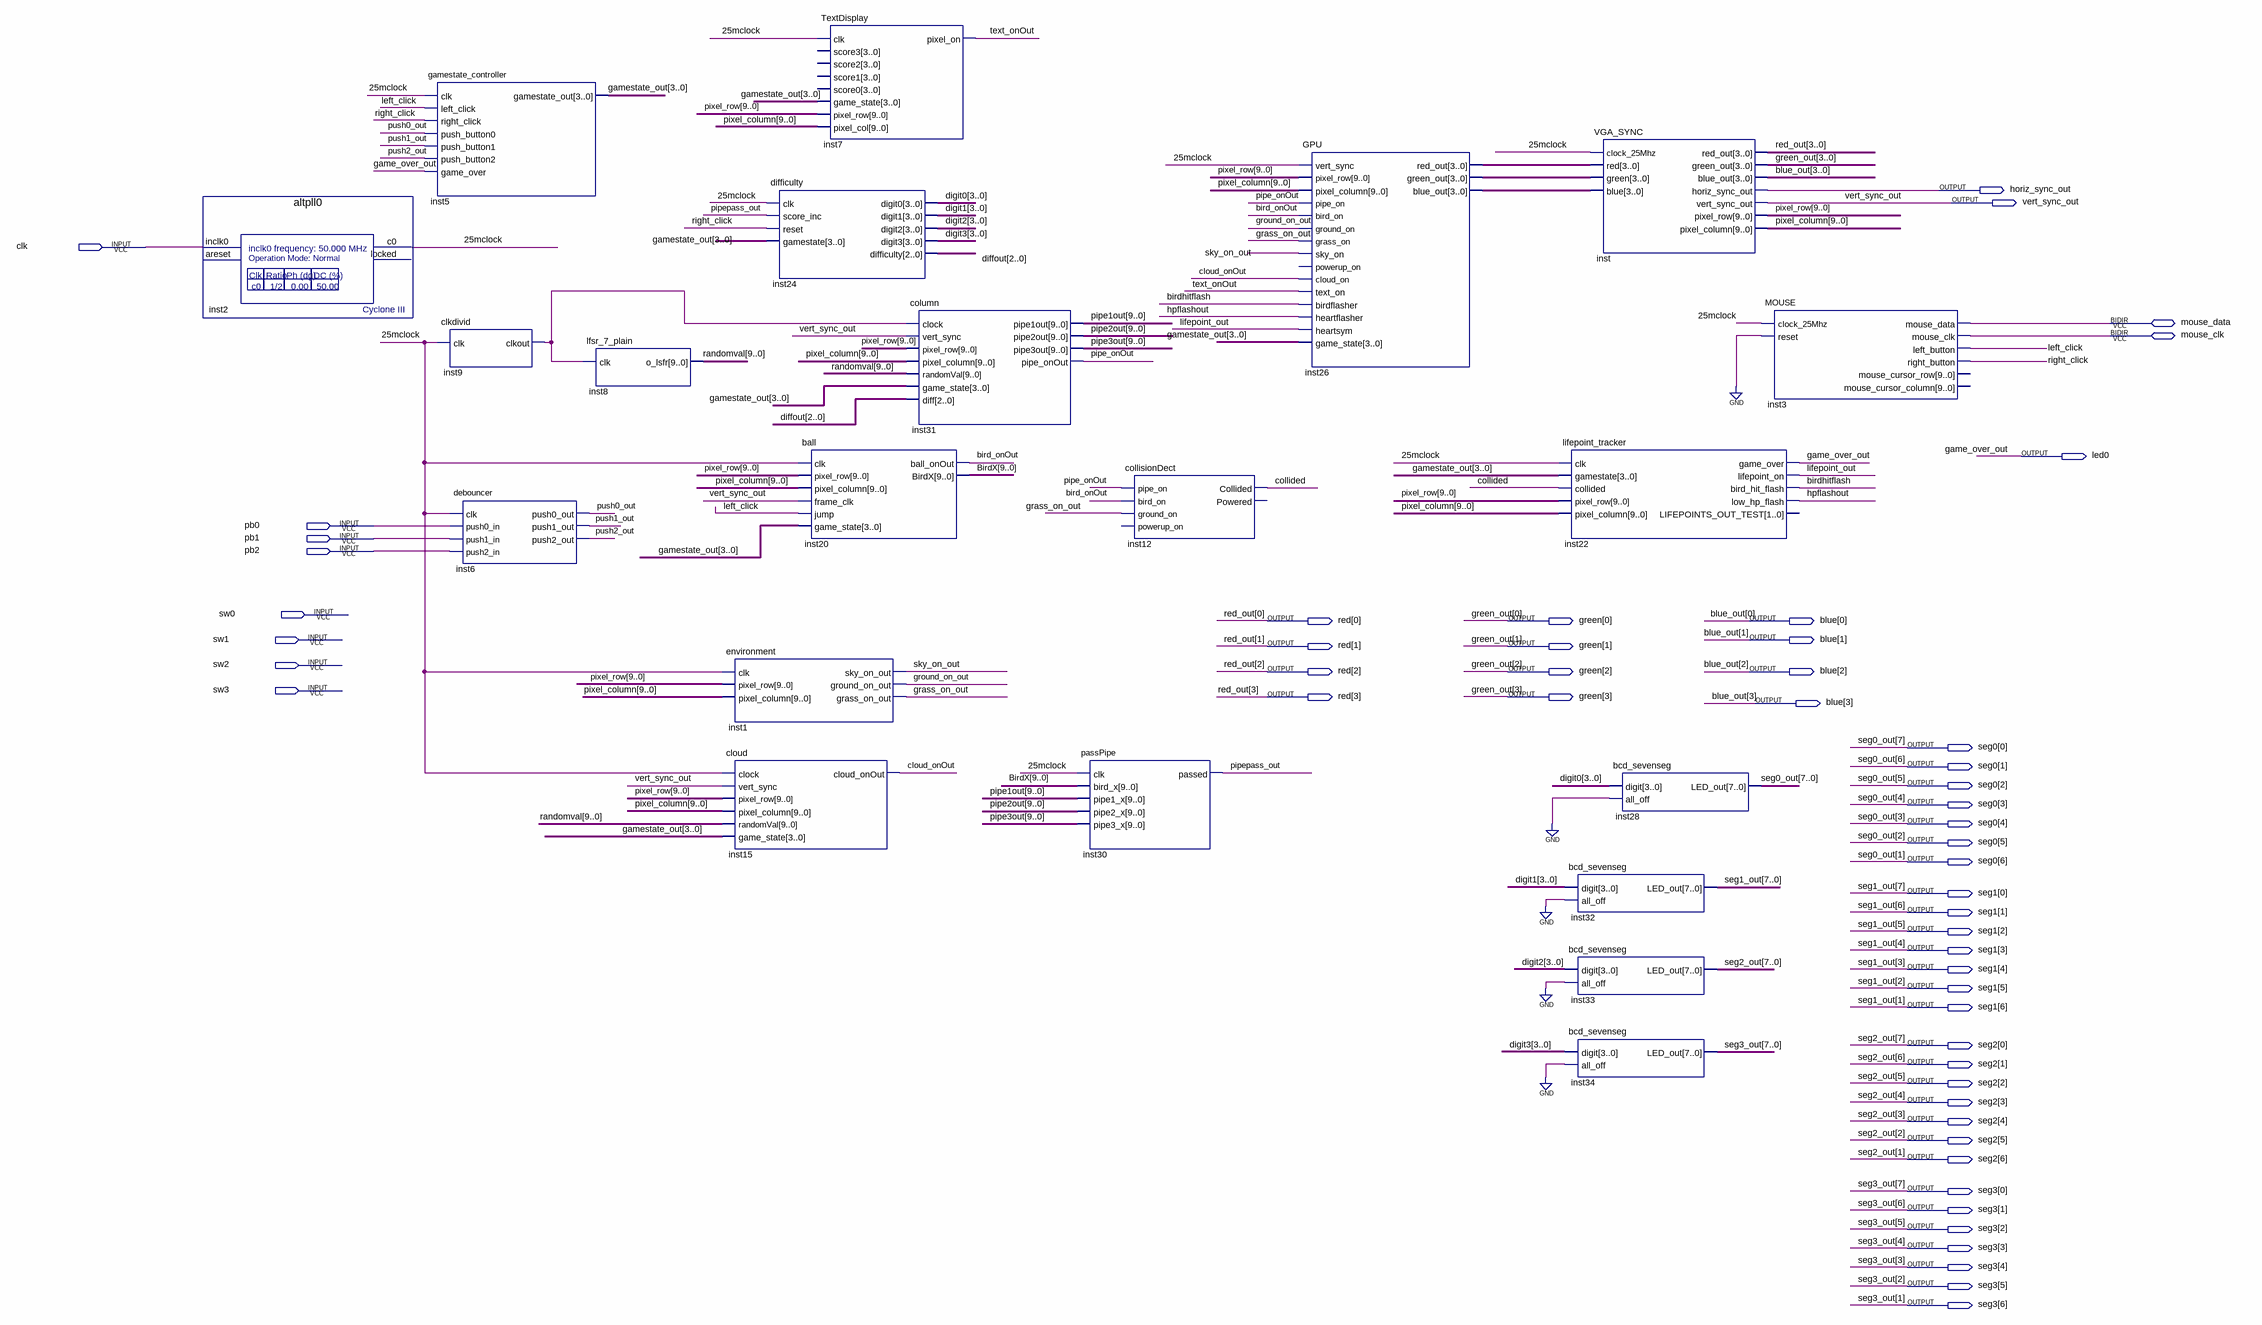
[diagram p0: schematic sheet]
// Quartus schematic flappydabird.bdf as structural Verilog: 21 symbols, 53 pins
module flappydabird (
  input  clk,
  input  pb0,
  input  pb1,
  input  pb2,
  input  sw0,
  input  sw1,
  input  sw2,
  input  sw3,
  inout  mouse_data,
  inout  mouse_clk,
  output horiz_sync_out,
  output vert_sync_out,
  output led0,
  output [3:0] red,
  output [3:0] green,
  output [3:0] blue,
  output [6:0] seg0,
  output [6:0] seg1,
  output [6:0] seg2,
  output [6:0] seg3
);

  wire \25mclock , bird_onOut, birdhitflash, cloud_onOut, collided, grass_on_out, ground_on_out, hpflashout,
       inst9_clkout, left_click, lifepoint_out, pipe_onOut, pipepass_out, push0_out, push1_out, push2_out,
       right_click, sky_on_out, text_onOut;
  wire [0:0] seg0_out, seg1_out, seg2_out, seg3_out;
  wire [2:0] diffout;
  wire [3:0] digit0, digit1, digit2, digit3, gamestate_out, inst26_blue_out, inst26_green_out, inst26_red_out;
  wire [9:0] BirdX, pipe1out, pipe2out, pipe3out, pixel_column, pixel_row, randomval;

  altpll0 inst2 (.inclk0(clk), .c0(\25mclock ));  // open: areset, locked
  gamestate_controller inst5 (
    .clk(\25mclock ), .left_click(left_click), .right_click(right_click), .push_button0(push0_out),
    .push_button1(push1_out), .push_button2(push2_out), .game_over(led0), .gamestate_out(gamestate_out));
  clkdivid inst9 (.clk(\25mclock ), .clkout(inst9_clkout));
  debouncer inst6 (
    .clk(\25mclock ), .push0_in(pb0), .push1_in(pb1), .push2_in(pb2), .push0_out(push0_out),
    .push1_out(push1_out), .push2_out(push2_out));
  lfsr_7_plain inst8 (.clk(inst9_clkout), .o_lsfr(randomval));
  environment inst1 (
    .clk(\25mclock ), .pixel_row(pixel_row), .pixel_column(pixel_column), .sky_on_out(sky_on_out),
    .ground_on_out(ground_on_out), .grass_on_out(grass_on_out));
  cloud inst15 (
    .clock(\25mclock ), .vert_sync(vert_sync_out), .pixel_row(pixel_row), .pixel_column(pixel_column),
    .randomVal(randomval), .game_state(gamestate_out), .cloud_onOut(cloud_onOut));
  difficulty inst24 (
    .clk(\25mclock ), .score_inc(pipepass_out), .reset(right_click), .gamestate(gamestate_out),
    .digit0(digit0), .digit1(digit1), .digit2(digit2), .digit3(digit3), .difficulty(diffout));
  TextDisplay inst7 (
    .clk(\25mclock ), .game_state(gamestate_out), .pixel_row(pixel_row), .pixel_col(pixel_column),
    .pixel_on(text_onOut));  // open: score3, score2, score1, score0
  ball inst20 (
    .clk(\25mclock ), .pixel_row(pixel_row), .pixel_column(pixel_column), .frame_clk(vert_sync_out),
    .jump(left_click), .game_state(gamestate_out), .ball_onOut(bird_onOut), .BirdX(BirdX));
  column inst31 (
    .clock(inst9_clkout), .vert_sync(vert_sync_out), .pixel_row(pixel_row), .pixel_column(pixel_column),
    .randomVal(randomval), .game_state(gamestate_out), .diff(diffout), .pipe1out(pipe1out),
    .pipe2out(pipe2out), .pipe3out(pipe3out), .pipe_onOut(pipe_onOut));
  passPipe inst30 (
    .clk(\25mclock ), .bird_x(BirdX), .pipe1_x(pipe1out), .pipe2_x(pipe2out), .pipe3_x(pipe3out),
    .passed(pipepass_out));
  collisionDect inst12 (
    .pipe_on(pipe_onOut), .bird_on(bird_onOut), .ground_on(grass_on_out), .Collided(collided));  // open: powerup_on, Powered
  GPU inst26 (
    .vert_sync(\25mclock ), .pixel_row(pixel_row), .pixel_column(pixel_column), .pipe_on(pipe_onOut),
    .bird_on(bird_onOut), .ground_on(ground_on_out), .grass_on(grass_on_out), .sky_on(sky_on_out),
    .cloud_on(cloud_onOut), .text_on(text_onOut), .birdflasher(birdhitflash), .heartflasher(hpflashout),
    .heartsym(lifepoint_out), .game_state(gamestate_out), .red_out(inst26_red_out),
    .green_out(inst26_green_out), .blue_out(inst26_blue_out));  // open: powerup_on
  VGA_SYNC inst (
    .clock_25Mhz(\25mclock ), .red(inst26_red_out), .green(inst26_green_out), .blue(inst26_blue_out),
    .red_out(red), .green_out(green), .blue_out(blue), .horiz_sync_out(horiz_sync_out),
    .vert_sync_out(vert_sync_out), .pixel_row(pixel_row), .pixel_column(pixel_column));
  lifepoint_tracker inst22 (
    .clk(\25mclock ), .gamestate(gamestate_out), .collided(collided), .pixel_row(pixel_row),
    .pixel_column(pixel_column), .game_over(led0), .lifepoint_on(lifepoint_out),
    .bird_hit_flash(birdhitflash), .low_hp_flash(hpflashout));  // open: LIFEPOINTS_OUT_TEST
  bcd_sevenseg inst32 (
    .digit(digit1), .all_off(1'b0),
    .LED_out({seg1[0], seg1[1], seg1[2], seg1[3], seg1[4], seg1[5], seg1[6], seg1_out[0]}));
  bcd_sevenseg inst33 (
    .digit(digit2), .all_off(1'b0),
    .LED_out({seg2[0], seg2[1], seg2[2], seg2[3], seg2[4], seg2[5], seg2[6], seg2_out[0]}));
  bcd_sevenseg inst34 (
    .digit(digit3), .all_off(1'b0),
    .LED_out({seg3[0], seg3[1], seg3[2], seg3[3], seg3[4], seg3[5], seg3[6], seg3_out[0]}));
  bcd_sevenseg inst28 (
    .digit(digit0), .all_off(1'b0),
    .LED_out({seg0[0], seg0[1], seg0[2], seg0[3], seg0[4], seg0[5], seg0[6], seg0_out[0]}));
  MOUSE inst3 (
    .clock_25Mhz(\25mclock ), .reset(1'b0), .left_button(left_click), .right_button(right_click),
    .mouse_data(mouse_data), .mouse_clk(mouse_clk));  // open: mouse_cursor_row, mouse_cursor_column

  // Other names for the same wires on the sheet: blue_out[3:0] = blue; game_over_out = led0; green_out[3:0] = green;
  //   red_out[3:0] = red; seg0_out[7:1] = {seg0[0], seg0[1], seg0[2], seg0[3], seg0[4], seg0[5], seg0[6]};
  //   seg1_out[7:1] = {seg1[0], seg1[1], seg1[2], seg1[3], seg1[4], seg1[5], seg1[6]};
  //   seg2_out[7:1] = {seg2[0], seg2[1], seg2[2], seg2[3], seg2[4], seg2[5], seg2[6]};
  //   seg3_out[7:1] = {seg3[0], seg3[1], seg3[2], seg3[3], seg3[4], seg3[5], seg3[6]}
endmodule
